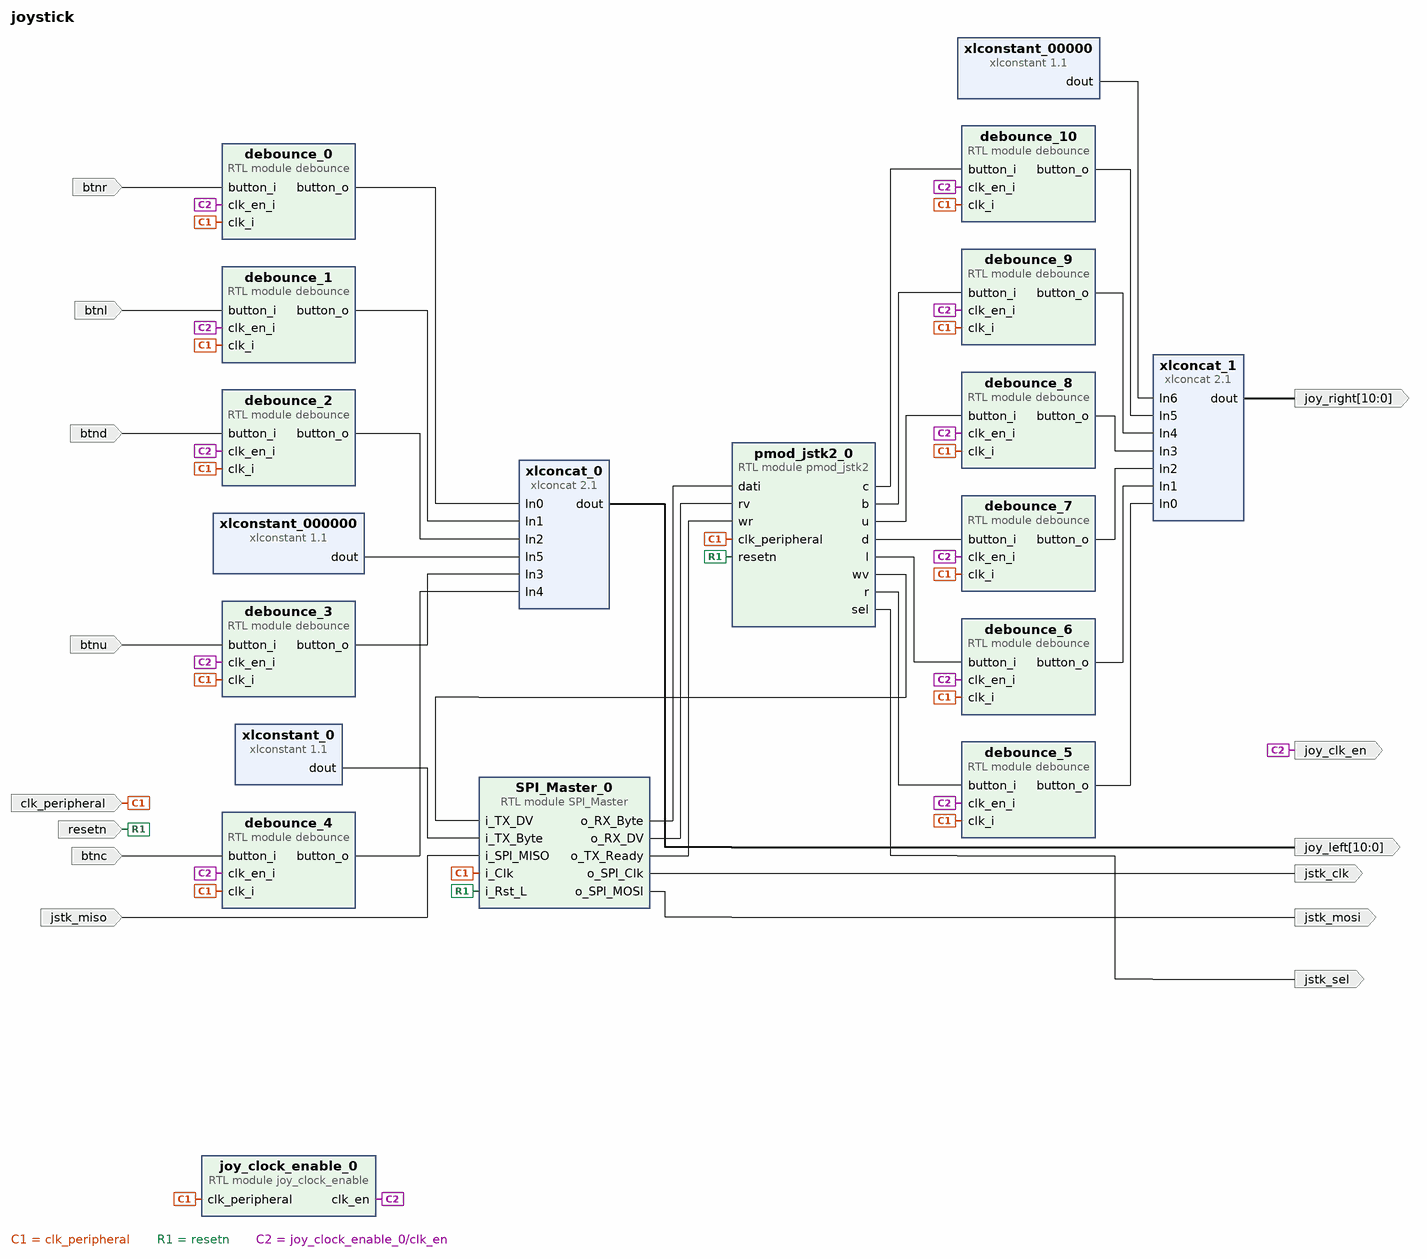
[diagram p0: block diagram of the top level]
# Vivado block design joystick, xc7a100tcsg324-1, Vivado 2021.2.1
create_bd_design joystick

create_bd_port -dir I btnc
create_bd_port -dir I btnd
create_bd_port -dir I btnl
create_bd_port -dir I btnr
create_bd_port -dir I btnu
create_bd_port -dir I -type clk clk_peripheral
set_property -dict {CONFIG.FREQ_HZ 28000000} [get_bd_ports clk_peripheral]
create_bd_port -dir O -from 10 -to 0 joy_left
create_bd_port -dir O -from 10 -to 0 joy_right
create_bd_port -dir O -type clk jstk_clk
create_bd_port -dir I jstk_miso
create_bd_port -dir O jstk_mosi
create_bd_port -dir O jstk_sel
create_bd_port -dir O -type ce joy_clk_en
create_bd_port -dir I -type rst resetn

create_bd_cell -type module -reference SPI_Master SPI_Master_0
set_property -dict {CONFIG.CLKS_PER_HALF_BIT 14} [get_bd_cells SPI_Master_0]
create_bd_cell -type ip -vlnv xilinx.com:ip:xlconstant:1.1 xlconstant_0
set_property -dict {CONFIG.CONST_VAL 0xc0 CONFIG.CONST_WIDTH 8} [get_bd_cells xlconstant_0]
create_bd_cell -type ip -vlnv xilinx.com:ip:xlconstant:1.1 xlconstant_000000
set_property -dict {CONFIG.CONST_VAL 0 CONFIG.CONST_WIDTH 6} [get_bd_cells xlconstant_000000]
create_bd_cell -type ip -vlnv xilinx.com:ip:xlconstant:1.1 xlconstant_00000
set_property -dict {CONFIG.CONST_VAL 0 CONFIG.CONST_WIDTH 5} [get_bd_cells xlconstant_00000]
create_bd_cell -type ip -vlnv xilinx.com:ip:xlconcat:2.1 xlconcat_0
set_property -dict {CONFIG.NUM_PORTS 6} [get_bd_cells xlconcat_0]
create_bd_cell -type ip -vlnv xilinx.com:ip:xlconcat:2.1 xlconcat_1
set_property -dict {CONFIG.NUM_PORTS 7} [get_bd_cells xlconcat_1]
create_bd_cell -type module -reference debounce debounce_1
create_bd_cell -type module -reference debounce debounce_2
create_bd_cell -type module -reference debounce debounce_3
create_bd_cell -type module -reference debounce debounce_4
create_bd_cell -type module -reference debounce debounce_5
create_bd_cell -type module -reference debounce debounce_6
create_bd_cell -type module -reference debounce debounce_7
create_bd_cell -type module -reference debounce debounce_8
create_bd_cell -type module -reference debounce debounce_9
create_bd_cell -type module -reference debounce debounce_10
create_bd_cell -type module -reference joy_clock_enable joy_clock_enable_0
create_bd_cell -type module -reference debounce debounce_0
create_bd_cell -type module -reference pmod_jstk2 pmod_jstk2_0

# ---- connections ----

connect_bd_net [get_bd_ports clk_peripheral] \
  [get_bd_pins SPI_Master_0/i_Clk] [get_bd_pins debounce_5/clk_i] [get_bd_pins debounce_6/clk_i] \
  [get_bd_pins debounce_7/clk_i] [get_bd_pins debounce_8/clk_i] [get_bd_pins debounce_9/clk_i] \
  [get_bd_pins debounce_10/clk_i] [get_bd_pins debounce_1/clk_i] [get_bd_pins debounce_2/clk_i] \
  [get_bd_pins debounce_3/clk_i] [get_bd_pins debounce_4/clk_i] [get_bd_pins joy_clock_enable_0/clk_peripheral] \
  [get_bd_pins debounce_0/clk_i] [get_bd_pins pmod_jstk2_0/clk_peripheral]
connect_bd_net [get_bd_pins SPI_Master_0/o_RX_Byte] [get_bd_pins pmod_jstk2_0/dati]
connect_bd_net [get_bd_pins SPI_Master_0/o_RX_DV] [get_bd_pins pmod_jstk2_0/rv]
connect_bd_net [get_bd_pins SPI_Master_0/o_SPI_Clk] [get_bd_ports jstk_clk]
connect_bd_net [get_bd_pins SPI_Master_0/o_SPI_MOSI] [get_bd_ports jstk_mosi]
connect_bd_net [get_bd_pins SPI_Master_0/o_TX_Ready] [get_bd_pins pmod_jstk2_0/wr]
connect_bd_net -net btn_jstk_0_joystick [get_bd_pins xlconcat_0/dout] [get_bd_ports joy_left]
connect_bd_net [get_bd_ports btnc] [get_bd_pins debounce_4/button_i]
connect_bd_net [get_bd_ports btnd] [get_bd_pins debounce_2/button_i]
connect_bd_net [get_bd_ports btnl] [get_bd_pins debounce_1/button_i]
connect_bd_net [get_bd_ports btnr] [get_bd_pins debounce_0/button_i]
connect_bd_net [get_bd_ports btnu] [get_bd_pins debounce_3/button_i]
connect_bd_net [get_bd_pins debounce_0/button_o] [get_bd_pins xlconcat_0/In0]
connect_bd_net [get_bd_pins debounce_10/button_o] [get_bd_pins xlconcat_1/In5]
connect_bd_net [get_bd_pins debounce_1/button_o] [get_bd_pins xlconcat_0/In1]
connect_bd_net [get_bd_pins debounce_2/button_o] [get_bd_pins xlconcat_0/In2]
connect_bd_net [get_bd_pins debounce_3/button_o] [get_bd_pins xlconcat_0/In3]
connect_bd_net [get_bd_pins debounce_4/button_o] [get_bd_pins xlconcat_0/In4]
connect_bd_net [get_bd_pins debounce_5/button_o] [get_bd_pins xlconcat_1/In0]
connect_bd_net [get_bd_pins debounce_6/button_o] [get_bd_pins xlconcat_1/In1]
connect_bd_net [get_bd_pins debounce_7/button_o] [get_bd_pins xlconcat_1/In2]
connect_bd_net [get_bd_pins debounce_8/button_o] [get_bd_pins xlconcat_1/In3]
connect_bd_net [get_bd_pins debounce_9/button_o] [get_bd_pins xlconcat_1/In4]
connect_bd_net [get_bd_ports jstk_miso] [get_bd_pins SPI_Master_0/i_SPI_MISO]
connect_bd_net [get_bd_pins pmod_jstk2_0/d] [get_bd_pins debounce_7/button_i]
connect_bd_net -net pmod_jstk2_0_f1 [get_bd_pins pmod_jstk2_0/b] [get_bd_pins debounce_9/button_i]
connect_bd_net -net pmod_jstk2_0_f2 [get_bd_pins pmod_jstk2_0/c] [get_bd_pins debounce_10/button_i]
connect_bd_net -net pmod_jstk2_0_joystick [get_bd_pins xlconcat_1/dout] [get_bd_ports joy_right]
connect_bd_net [get_bd_pins pmod_jstk2_0/l] [get_bd_pins debounce_6/button_i]
connect_bd_net [get_bd_pins pmod_jstk2_0/r] [get_bd_pins debounce_5/button_i]
connect_bd_net [get_bd_pins pmod_jstk2_0/sel] [get_bd_ports jstk_sel]
connect_bd_net [get_bd_pins pmod_jstk2_0/u] [get_bd_pins debounce_8/button_i]
connect_bd_net [get_bd_pins pmod_jstk2_0/wv] [get_bd_pins SPI_Master_0/i_TX_DV]
connect_bd_net [get_bd_ports resetn] [get_bd_pins pmod_jstk2_0/resetn] [get_bd_pins SPI_Master_0/i_Rst_L]
connect_bd_net [get_bd_pins xlconstant_000000/dout] [get_bd_pins xlconcat_0/In5]
connect_bd_net [get_bd_pins xlconstant_00000/dout] [get_bd_pins xlconcat_1/In6]
connect_bd_net [get_bd_pins xlconstant_0/dout] [get_bd_pins SPI_Master_0/i_TX_Byte]
connect_bd_net -net xlconstant_1_dout [get_bd_pins joy_clock_enable_0/clk_en] \
  [get_bd_pins debounce_1/clk_en_i] [get_bd_pins debounce_5/clk_en_i] [get_bd_pins debounce_6/clk_en_i] \
  [get_bd_pins debounce_7/clk_en_i] [get_bd_pins debounce_8/clk_en_i] [get_bd_pins debounce_9/clk_en_i] \
  [get_bd_pins debounce_10/clk_en_i] [get_bd_pins debounce_2/clk_en_i] [get_bd_pins debounce_3/clk_en_i] \
  [get_bd_pins debounce_4/clk_en_i] [get_bd_ports joy_clk_en] [get_bd_pins debounce_0/clk_en_i]

validate_bd_design
save_bd_design
